# EAGLE schematic apollobvm_pcb (EAGLE 9.6.0)
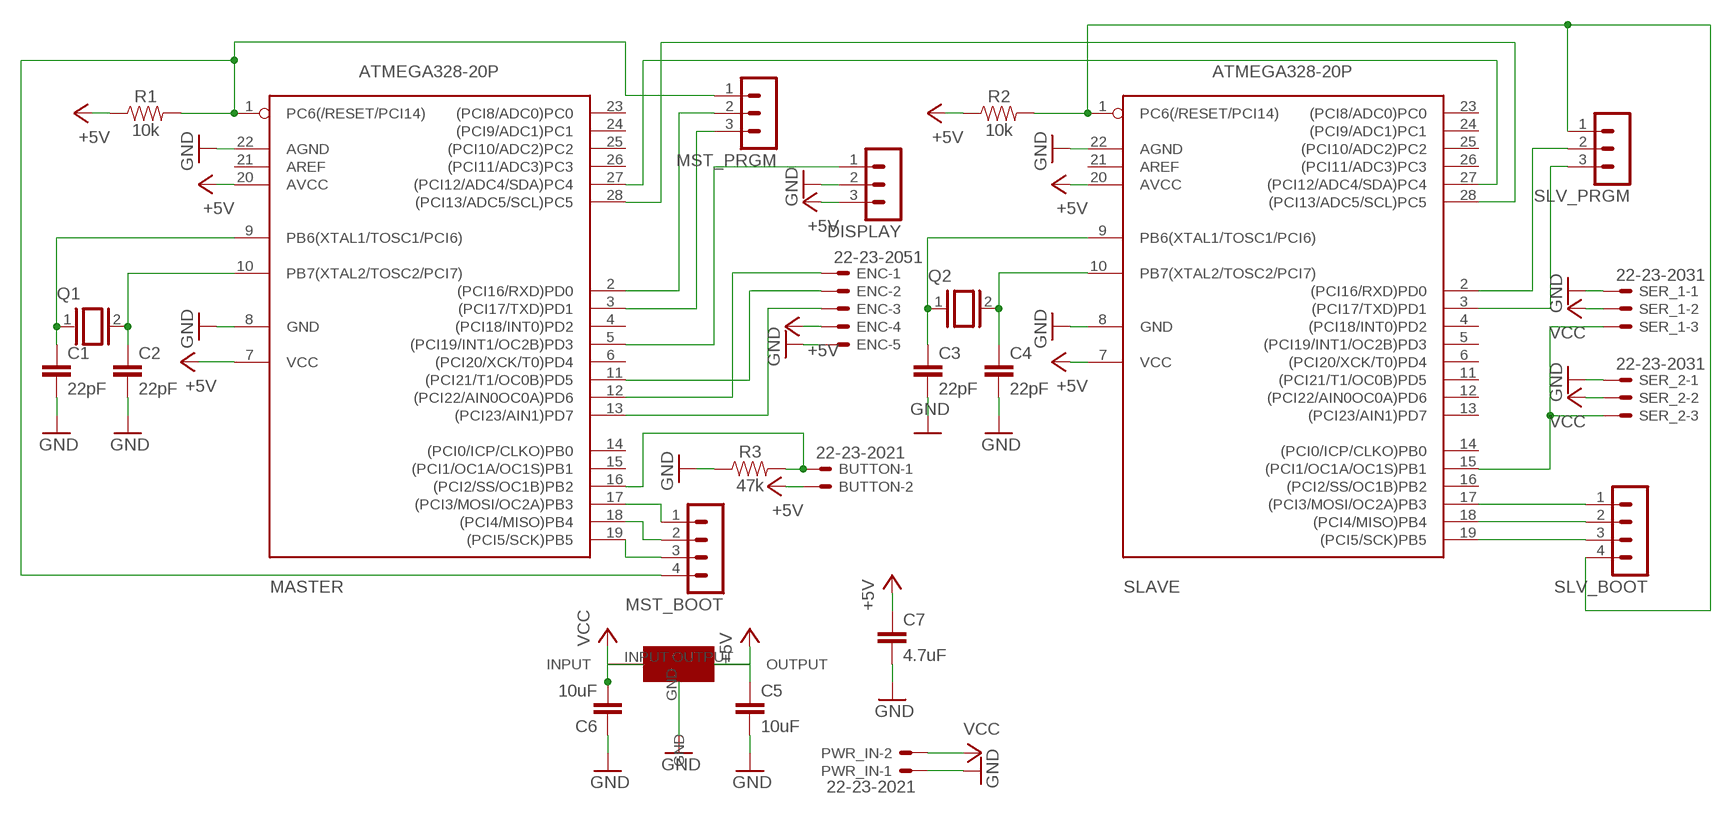
[diagram p0: schematic, sheet 1]

## Parts
BUTTON  22-23-2021  [22-23-2021]
C1  22pF  22PF-0603-50V-5%  [0603]
C2  22pF  22PF-0603-50V-5%  [0603]
C3  22pF  22PF-0603-50V-5%  [0603]
C4  22pF  22PF-0603-50V-5%  [0603]
C5  10uF  10UF-0603-6.3V-20%  [0603]
C6  10uF  10UF-0603-6.3V-20%  [0603]
C7  4.7uF  4.7UF0603  [0603]
DISPLAY  MA03-1  [MA03-1]
ENC  22-23-2051  [22-23-2051]
MASTER  ATMEGA328-20P  [DIL28-3]
MST_BOOT  MA04-1  [MA04-1]
MST_PRGM  MA03-1  [MA03-1]
PWR_IN  22-23-2021  [22-23-2021]
Q1  XTAL/S  [QS]
Q2  XTAL/S  [QS]
R1  10k  10KOHM-0603-1/10W-1%  [0603]
R2  10k  10KOHM-0603-1/10W-1%  [0603]
R3  47k  47KOHM-0603-1/10W-1%  [0603]
SER_1  22-23-2031  [22-23-2031]
SER_2  22-23-2031  [22-23-2031]
SLAVE  ATMEGA328-20P  [DIL28-3]
SLV_BOOT  MA04-1  [MA04-1]
SLV_PRGM  MA03-1  [MA03-1]
U$1  NCP1117  [NCP1117]

## Nets
+5V: BUTTON.2 C5.1 C7.1 DISPLAY.3 ENC.4 MASTER.7(VCC) MASTER.20(AVCC) R1.1 R2.1 SLAVE.7(VCC) SLAVE.20(AVCC) U$1.OUTPUT
GND: C1.2 C2.2 C3.2 C4.2 C5.2 C6.1 C7.2 DISPLAY.2 ENC.5 MASTER.8(GND) MASTER.22(AGND) PWR_IN.1 R3.1 SER_1.1 SER_2.1 SLAVE.8(GND) SLAVE.22(AGND) U$1.GND
N$1: MASTER.1(PC6(/RESET/PCI14)) MST_BOOT.4 MST_PRGM.1 R1.2
N$2: R2.2 SLAVE.1(PC6(/RESET/PCI14)) SLV_BOOT.4 SLV_PRGM.1
N$3: C3.1 Q2.1 SLAVE.9(PB6(XTAL1/TOSC1/PCI6))
N$4: C4.1 Q2.2 SLAVE.10(PB7(XTAL2/TOSC2/PCI7))
N$5: C1.1 MASTER.9(PB6(XTAL1/TOSC1/PCI6)) Q1.1
N$6: C2.1 MASTER.10(PB7(XTAL2/TOSC2/PCI7)) Q1.2
N$7: SER_1.3 SER_2.3 SLAVE.15((PCI1/OC1A/OC1S)PB1)
N$8: DISPLAY.1 MASTER.5((PCI19/INT1/OC2B)PD3)
N$9: ENC.3 MASTER.13((PCI23/AIN1)PD7)
N$10: ENC.2 MASTER.11((PCI21/T1/OC0B)PD5)
N$11: MASTER.27((PCI12/ADC4/SDA)PC4) SLAVE.27((PCI12/ADC4/SDA)PC4)
N$12: ENC.1 MASTER.12((PCI22/AIN0OC0A)PD6)
N$13: MASTER.28((PCI13/ADC5/SCL)PC5) SLAVE.28((PCI13/ADC5/SCL)PC5)
N$14: BUTTON.1 MASTER.16((PCI2/SS/OC1B)PB2) R3.2
N$15: SLAVE.17((PCI3/MOSI/OC2A)PB3) SLV_BOOT.1
N$16: SLAVE.18((PCI4/MISO)PB4) SLV_BOOT.2
N$17: SLAVE.19((PCI5/SCK)PB5) SLV_BOOT.3
N$18: MASTER.17((PCI3/MOSI/OC2A)PB3) MST_BOOT.1
N$19: MASTER.18((PCI4/MISO)PB4) MST_BOOT.2
N$20: MASTER.19((PCI5/SCK)PB5) MST_BOOT.3
N$22: SLAVE.2((PCI16/RXD)PD0) SLV_PRGM.2
N$23: SLAVE.3((PCI17/TXD)PD1) SLV_PRGM.3
N$24: MASTER.2((PCI16/RXD)PD0) MST_PRGM.2
N$25: MASTER.3((PCI17/TXD)PD1) MST_PRGM.3
VCC: C6.2 PWR_IN.2 SER_1.2 SER_2.2 U$1.INPUT
Unconnected: MASTER.4((PCI18/INT0)PD2) MASTER.6((PCI20/XCK/T0)PD4) MASTER.14((PCI0/ICP/CLKO)PB0) MASTER.15((PCI1/OC1A/OC1S)PB1) MASTER.21(AREF) MASTER.23((PCI8/ADC0)PC0) MASTER.24((PCI9/ADC1)PC1) MASTER.25((PCI10/ADC2)PC2) MASTER.26((PCI11/ADC3)PC3) SLAVE.4((PCI18/INT0)PD2) SLAVE.5((PCI19/INT1/OC2B)PD3) SLAVE.6((PCI20/XCK/T0)PD4) SLAVE.11((PCI21/T1/OC0B)PD5) SLAVE.12((PCI22/AIN0OC0A)PD6) SLAVE.13((PCI23/AIN1)PD7) SLAVE.14((PCI0/ICP/CLKO)PB0) SLAVE.16((PCI2/SS/OC1B)PB2) SLAVE.21(AREF) SLAVE.23((PCI8/ADC0)PC0) SLAVE.24((PCI9/ADC1)PC1) SLAVE.25((PCI10/ADC2)PC2) SLAVE.26((PCI11/ADC3)PC3)

## Library data of the parts
BUTTON PWR_IN = con-molex:22-23-2021: .100" (2.54mm) Center Header - 2 Pin; MF: MOLEX; MPN: 22-23-2021; OC_FARNELL: 1462926; OC_NEWARK: 25C3832
C1-C4 = SparkFun-Capacitors:22PF: 22pF ceramic capacitors A capacitor is a passive two-terminal electrical component used to store electrical energy temporarily in an electric field.; PROD_ID: CAP-07876
C5 C6 = SparkFun-Capacitors:10UF: 10.0µF ceramic capacitors A capacitor is a passive two-terminal electrical component used to store electrical energy temporarily in an electric field.; PROD_ID: CAP-11015
C7 = SparkFun-Capacitors:4.7UF: 4.7µF ceramic capacitors A capacitor is a passive two-terminal electrical component used to store electrical energy temporarily in an electric field.; PROD_ID: CAP-08280
DISPLAY MST_PRGM SLV_PRGM = con-lstb:MA03-1: PIN HEADER; OC_FARNELL: unknown; OC_NEWARK: unknown
ENC = con-molex:22-23-2051: .100" (2.54mm) Center Header - 5 Pin; MF: MOLEX; MPN: 22-23-2051; OC_FARNELL: 1462952; OC_NEWARK: 38C9178
MASTER SLAVE = atmega328:ATMEGA328*P: MICROCONTROLLER 32 kBytes FLASH 2 kBytes SRAM 1 kBytes EEPROM USART 8-channel 10 bit ADC
MST_BOOT SLV_BOOT = con-lstb:MA04-1: PIN HEADER; OC_FARNELL: unknown; OC_NEWARK: unknown
Q1 Q2 = apollobvm_pcb:XTAL/S: CRYSTAL
R1 R2 = SparkFun-Resistors:10KOHM: 10kΩ resistor A resistor is a passive two-terminal electrical component that implements electrical resistance as a circuit element. Resistors act to reduce current flow, and, at the same time, act to lower voltage levels within circuits. - Wikipedia; PROD_ID: RES-00824
R3 = SparkFun-Resistors:47KOHM: 47kΩ resistor A resistor is a passive two-terminal electrical component that implements electrical resistance as a circuit element. Resistors act to reduce current flow, and, at the same time, act to lower voltage levels within circuits. - Wikipedia; PROD_ID: RES-07871
SER_1 SER_2 = con-molex:22-23-2031: .100" (2.54mm) Center Header - 3 Pin; MF: MOLEX; MPN: 22-23-2031; OC_FARNELL: 1462950; OC_NEWARK: 30C0862
U$1 = apollobvm_pcb:NCP1117